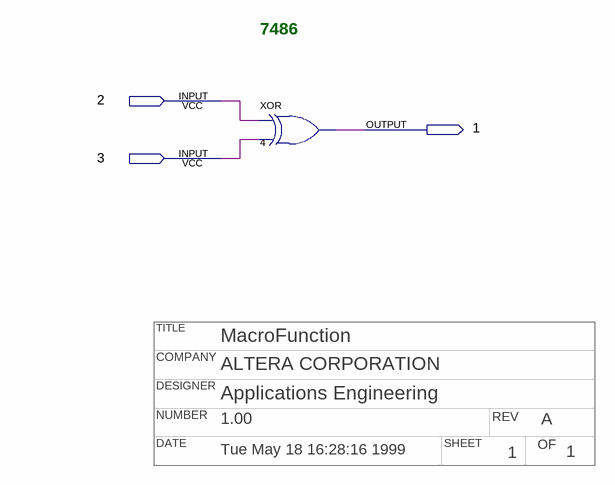
[diagram p0: schematic sheet]
// Quartus schematic 7486.bdf as structural Verilog: 1 symbols, 3 pins
// Title block: TITLE: MacroFunction; COMPANY: ALTERA CORPORATION; DESIGNER: Applications Engineering; NUMBER: 1.00; REV: A; DATE: Tue May 18 16:28:16 1999; SHEET: 1; OF: 1
module \7486  (
  input  \2 ,
  input  \3 ,
  output \1 
);

  xor u_4 (\1 , \2 , \3 );

  // Notes on the sheet:
  //   7486
endmodule
